# EAGLE schematic Lamp_dispatcher (EAGLE 7.3.0)
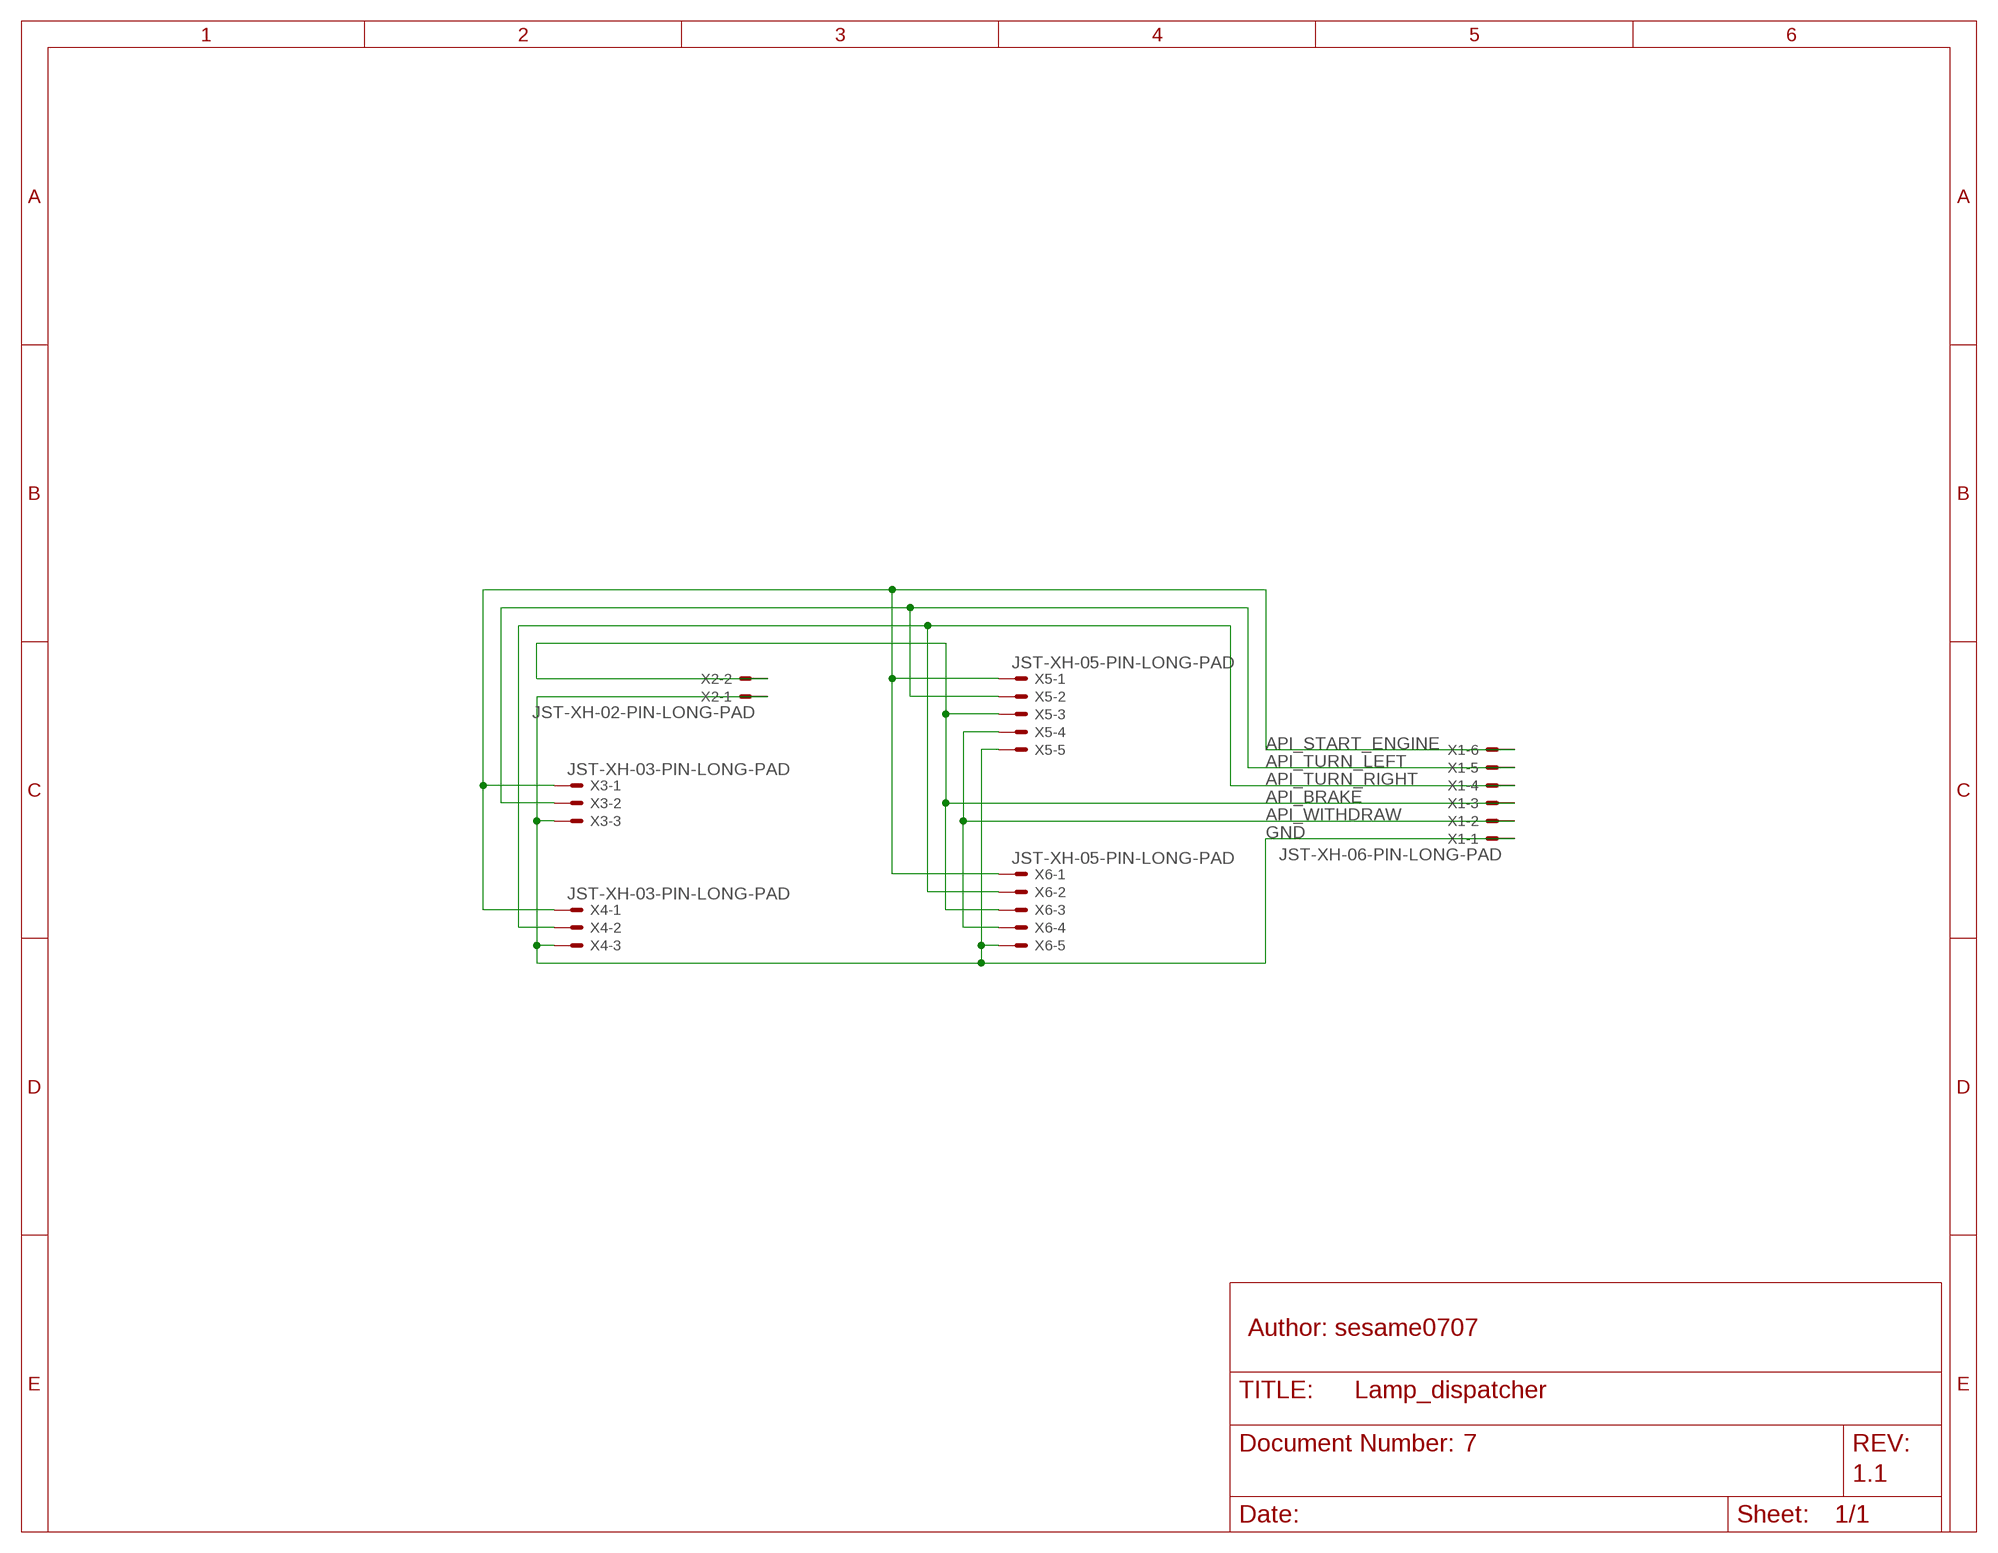
[diagram p0: schematic, sheet 1]

## Parts
X1  JST-XH-06-PIN-LONG-PAD  [JST-XH-06-PACKAGE-LONG-PAD]
X2  JST-XH-02-PIN-LONG-PAD  [JST-XH-02-PACKAGE-LONG-PAD]
X3  JST-XH-03-PIN-LONG-PAD  [JST-XH-03-PACKAGE-LONG-PAD]
X4  JST-XH-03-PIN-LONG-PAD  [JST-XH-03-PACKAGE-LONG-PAD]
X5  JST-XH-05-PIN-LONG-PAD  [JST-XH-05-PACKAGE-LONG-PAD]
X6  JST-XH-05-PIN-LONG-PAD  [JST-XH-05-PACKAGE-LONG-PAD]

## Nets
API_BRAKE: X1.3 X2.2 X5.3 X6.3
API_START_ENGINE: X1.6 X3.1 X4.1 X5.1 X6.1
API_TURN_LEFT: X1.5 X3.2 X5.2
API_TURN_RIGHT: X1.4 X4.2 X6.2
API_WITHDRAW: X1.2 X5.4 X6.4
GND: X1.1 X2.1 X3.3 X4.3 X5.5 X6.5

## Notes on the sheet
- Author: sesame0707
- 7
- 1.1

## Library data of the parts
X1 = Rembrandt Electronics - JST XH Connectors v1-0:JST-XH-06-PIN: JST XH Connector 2 Pin Wire to board connector. Pitch: 2,54 mm, (0.100") Number of pins: 6 Created by Rembrandt Electronics www.rembrandtelectronics.com
X2 = Rembrandt Electronics - JST XH Connectors v1-0:JST-XH-02-PIN: JST XH Connector 2 Pin Wire to board connector. Pitch: 2,54 mm, (0.100") Number of pins: 2 Created by Rembrandt Electronics www.rembrandtelectronics.com
X3 X4 = Rembrandt Electronics - JST XH Connectors v1-0:JST-XH-03-PIN: JST XH Connector 2 Pin Wire to board connector. Pitch: 2,54 mm, (0.100") Number of pins: 3 Created by Rembrandt Electronics www.rembrandtelectronics.com
X5 X6 = Rembrandt Electronics - JST XH Connectors v1-0:JST-XH-05-PIN: JST XH Connector 2 Pin Wire to board connector. Pitch: 2,54 mm, (0.100") Number of pins: 5 Created by Rembrandt Electronics www.rembrandtelectronics.com